# Altium schematic sheet connectors.schdoc
size 157 x 67 mm
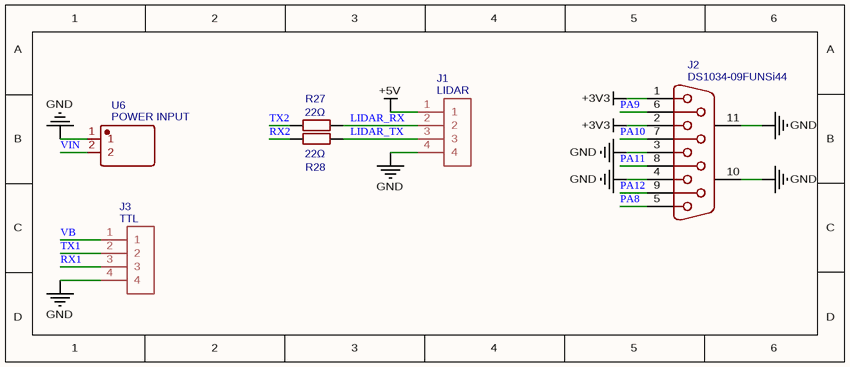
[diagram p0: connectors.schdoc]

## Parts
J1  LIDAR  [MOLEX_0530470410]
J2  DS1034-09FUNSi44  [DSUB-TH_2-5747706-0]
J3  TTL  [MOLEX_0530470410]
R27  22Ω  [R0402]
R28  22Ω  [R0402]
U6  POWER INPUT  [CONN-TH_B2B-XH-A-GU]

## Nets
+3V3: J2.1 J2.2
+5V: J1.1
GND: J1.4 J2.3 J2.4 J2.10(MH1) J2.11(MH2) J3.4 U6.1
LIDAR_RX: J1.2 R27.2
LIDAR_TX: J1.3 R28.2
PA8: J2.5
PA9: J2.6
PA10: J2.7
PA11: J2.8
PA12: J2.9
RX1: J3.3
RX2: R28.1
TX1: J3.2
TX2: R27.1
VB: J3.1
VIN: U6.2

## Library data of the parts
J1 = LIDAR: Contributor: Nicola Lorenzini; spicePre: J; spiceSymbolName: 0530470410
J2 = DS1034-09FUNSi44: Manufacturer: CONNFLY; Contributor: LCSC; Supplier: LCSC; Manufacturer Part: DS1034-09FUNSi44; Supplier Part: C77831; JLCPCB Part Class: Extended Part; spicePre: J; spiceSymbolName: DS1034-09FUNSi44
J3 = TTL: Contributor: Nicola Lorenzini; spicePre: J; spiceSymbolName: 0530470410
R27 R28 = 22Ω: Manufacturer: UNI-ROYAL(厚声); Manufacturer Part: 0402WGF220JTCE; nameAlias: Value; Supplier: LCSC; Supplier Part: C25092; JLCPCB Part Class: Basic Part; spicePre: R; spiceSymbolName: 0402WGF220JTCE
U6 = POWER INPUT: Manufacturer: JST; Manufacturer Part: B2B-XH-A-GU; Contributor: LCSC; Supplier: LCSC; Supplier Part: C265283; JLCPCB Part Class: Extended Part; spicePre: U; spiceSymbolName: B2B-XH-A-GU